# EasyEDA Pro project couple-pointing.eprj

# Schematic Schematic1
Create Date: 2023-10-11; Page Name: P1; Project Name: couple-pointing; Schematic Name: Schematic1; Update Date: 2023-10-14; Company: 嘉立创EDA; Page Size: A4; Version: V1.0
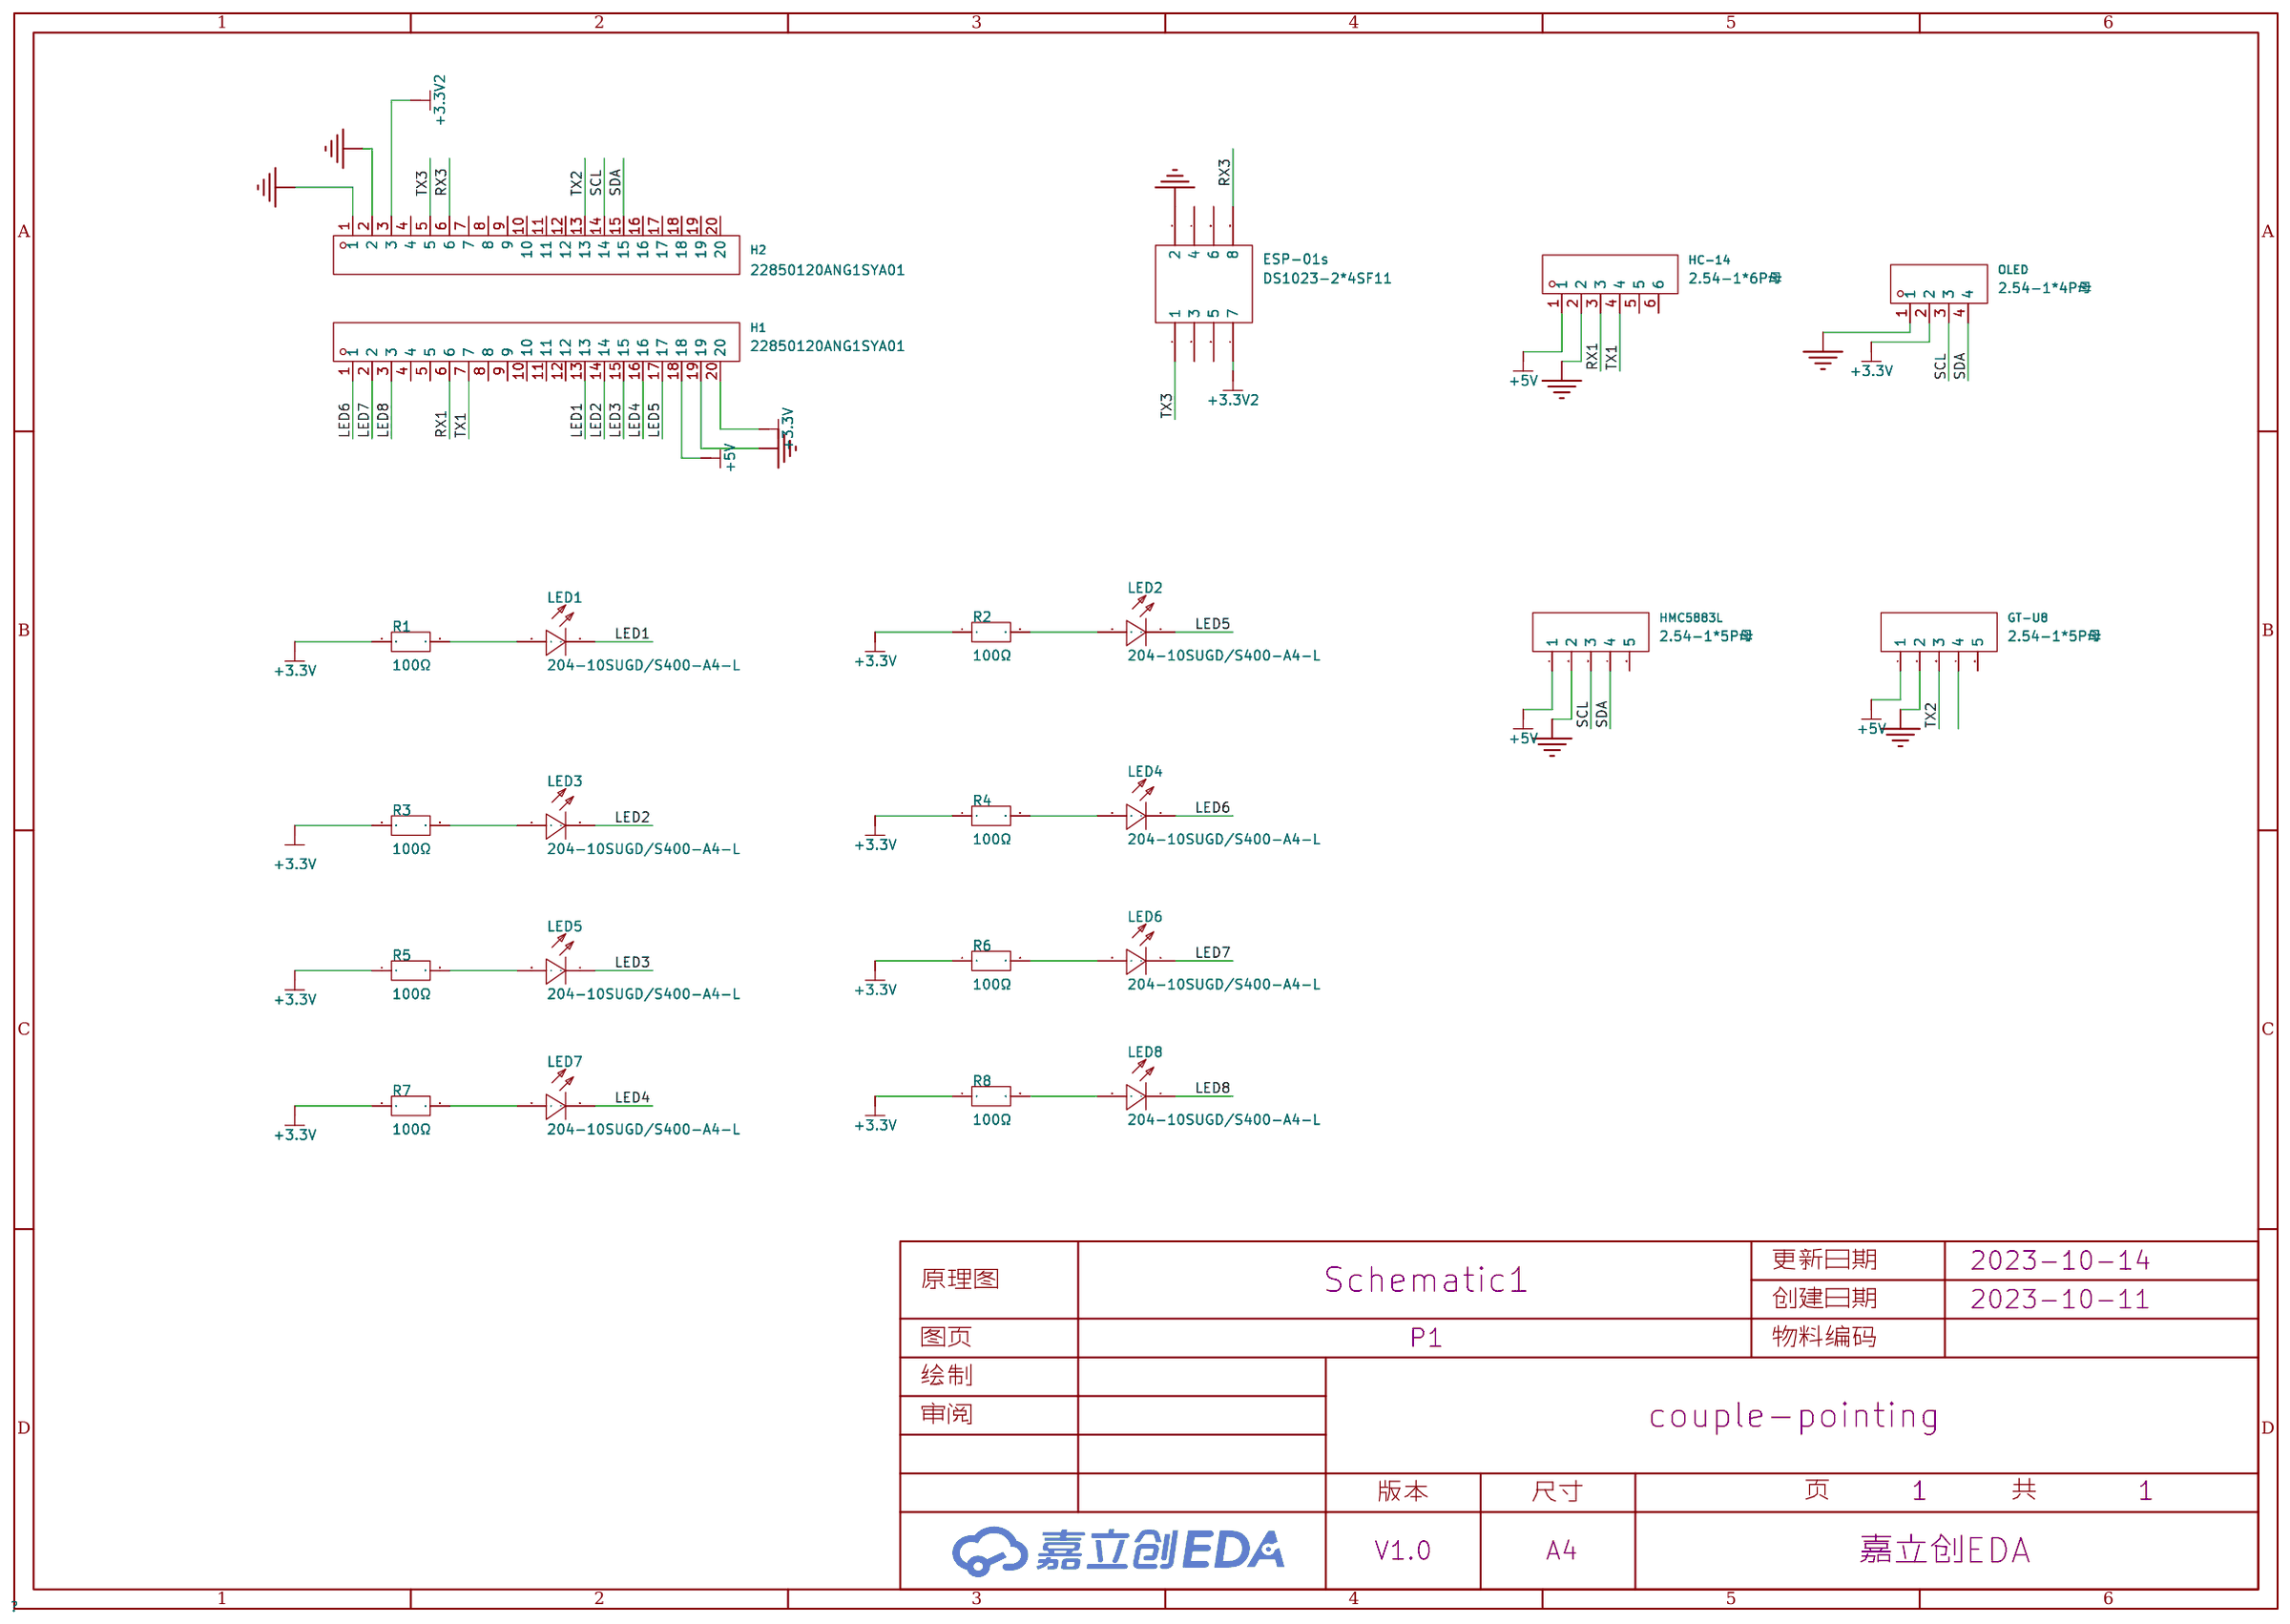
[diagram p0: schematic sheet]

## Parts
ESP-01s  DS1023-2*4SF11  [HDR-TH_8P-P2.54-V-F-R2-C4-S2.54]
GT-U8  2.54-1*5P母  [HDR-TH_5P-P2.54-V-F]
H1  22850120ANG1SYA01  [HDR-TH_20P-P2.54-V-F]
H2  22850120ANG1SYA01  [HDR-TH_20P-P2.54-V-F]
HC-14  2.54-1*6P母  [HDR-TH_6P-P2.54-V-F]
HMC5883L  2.54-1*5P母  [HDR-TH_5P-P2.54-V-F]
LED1  204-10SUGD/S400-A4-L  [LED-TH_BD3.9-P2.54-RD]
LED2  204-10SUGD/S400-A4-L  [LED-TH_BD3.9-P2.54-RD]
LED3  204-10SUGD/S400-A4-L  [LED-TH_BD3.9-P2.54-RD]
LED4  204-10SUGD/S400-A4-L  [LED-TH_BD3.9-P2.54-RD]
LED5  204-10SUGD/S400-A4-L  [LED-TH_BD3.9-P2.54-RD]
LED6  204-10SUGD/S400-A4-L  [LED-TH_BD3.9-P2.54-RD]
LED7  204-10SUGD/S400-A4-L  [LED-TH_BD3.9-P2.54-RD]
LED8  204-10SUGD/S400-A4-L  [LED-TH_BD3.9-P2.54-RD]
OLED  2.54-1*4P母  [HDR-TH_4P-P2.54-V-F]
R1  100Ω  [RES-TH_BD2.4-L6.3-P10.30-D0.6]
R2  100Ω  [RES-TH_BD2.4-L6.3-P10.30-D0.6]
R3  100Ω  [RES-TH_BD2.4-L6.3-P10.30-D0.6]
R4  100Ω  [RES-TH_BD2.4-L6.3-P10.30-D0.6]
R5  100Ω  [RES-TH_BD2.4-L6.3-P10.30-D0.6]
R6  100Ω  [RES-TH_BD2.4-L6.3-P10.30-D0.6]
R7  100Ω  [RES-TH_BD2.4-L6.3-P10.30-D0.6]
R8  100Ω  [RES-TH_BD2.4-L6.3-P10.30-D0.6]

## Library data of the parts
ESP-01s = DS1023-2*4SF11: 排数:双排;总孔位数:8P;间距:2.54mm;插孔结构:2x4P;行距:2.54mm;安装类型:直插;塑高:-;触头材质:-;触头镀层:-;; LCSC Part Name: 间距:2.54mm 2x4P 直插 黑色，镀全金; Supplier Part: C92271; Manufacturer: CONNFLY; Supplier Footprint: 插件,P=2.54mm; JLCPCB Part Class: 扩展库; Datasheet: https://atta.szlcsc.com/upload/public/pdf/source/20170925/C132132_1506321659018990428.pdf; Supplier: LCSC; Number of Rows: 双排; Number of Holes: 8P; Pitch: 2.54mm; Holes Structure: 2x4P; Row Spacing: 2.54mm; Mounting Type: 直插
GT-U8 HMC5883L = 2.54-1*5P母: 排数:单排;总孔位数:5P;间距:2.54mm;插孔结构:1x5P;行距:-;安装类型:直插;塑高:-;触头材质:-;触头镀层:-;; LCSC Part Name: 2.54mm 1x5P; Supplier Part: C50950; Manufacturer: BOOMELE(博穆精密); Supplier Footprint: 插件,P=2.54mm; JLCPCB Part Class: 扩展库; Datasheet: https://atta.szlcsc.com/upload/public/pdf/source/20210301/C2718488_F4427B881E42CAA8DDB0B1C12B3A522C.pdf; Supplier: LCSC; Number of Rows: 单排; Number of Holes: 5P; Pitch: 2.54mm; Holes Structure: 1x5P; Mounting Type: 直插
H1 H2 = 22850120ANG1SYA01: 排数:单排;总孔位数:20P;间距:2.54mm;插孔结构:1x20P;行距:-;安装类型:直插;塑高:-;触头材质:黄铜;触头镀层:-;; LCSC Part Name: 2.54mm 1x20P; Supplier Part: C429947; Manufacturer: JILN(锦凌); Supplier Footprint: 插件,P=2.54mm; JLCPCB Part Class: 扩展库; Datasheet: https://atta.szlcsc.com/upload/public/pdf/source/20190920/C429966_F6288D72CB1EF194DAF75E8AC5D57877.pdf; Supplier: LCSC; Number of Rows: 单排; Number of Holes: 20P; Pitch: 2.54mm; Holes Structure: 1x20P; Mounting Type: 直插; Contact Material: 黄铜
HC-14 = 2.54-1*6P母: 排数:单排;总孔位数:6P;间距:2.54mm;插孔结构:1x6P;行距:-;安装类型:直插;塑高:-;触头材质:-;触头镀层:-;; LCSC Part Name: 2.54mm 1x6P; Supplier Part: C40877; Manufacturer: BOOMELE(博穆精密); Supplier Footprint: 插件,P=2.54mm; JLCPCB Part Class: 扩展库; Datasheet: https://atta.szlcsc.com/upload/public/pdf/source/20210301/C2718488_F4427B881E42CAA8DDB0B1C12B3A522C.pdf; Supplier: LCSC; Number of Rows: 单排; Number of Holes: 6P; Pitch: 2.54mm; Holes Structure: 1x6P; Mounting Type: 直插
LED1-LED8 = 204-10SUGD/S400-A4-L: Supplier Part: C778892; Manufacturer: EVERLIGHT(亿光); Supplier Footprint: 插件; JLCPCB Part Class: Extended Part; Supplier: LCSC
OLED = 2.54-1*4P母: 排数:单排;总孔位数:4P;间距:2.54mm;插孔结构:1x4P;行距:-;安装类型:直插;圆孔/方孔:方孔;额定电流:3A;额定电压:-;插孔方向:顶部;塑高:-;触头材质:青铜;触头镀层:-;工作温度范围:-40℃~+105℃;焊接温度(最大值):-;; LCSC Part Name: 2.54mm 1x4P; Supplier Part: C2718488; Manufacturer: BOOMELE(博穆精密); Supplier Footprint: 插件,P=2.54mm; JLCPCB Part Class: 扩展库; Datasheet: https://atta.szlcsc.com/upload/public/pdf/source/20210301/C2718488_F4427B881E42CAA8DDB0B1C12B3A522C.pdf; Supplier: LCSC; Number of Rows: 单排; Number of Holes: 4P; Pitch: 2.54mm; Holes Structure: 1x4P; Mounting Type: 直插; Circular Hole / Square Hole: 方孔; Current Rating (Max): 3A; Holes Direction: 顶部; Contact Material: 青铜; Operating Temperature Range: -40℃~+105℃
R1-R8 = RN 1/4W 100R F T/B A1: 电阻类型:金属膜电阻;阻值:100Ω;精度:±1%;功率:250mW;温度系数:±50ppm/℃;最大工作电压:250V;工作温度范围:-55℃~+125℃;; LCSC Part Name: 金属膜电阻 100Ω ±1% 250mW; Supplier Part: C410697; Manufacturer: Tyohm(幸亚电阻); Supplier Footprint: 轴向引线; JLCPCB Part Class: Extended Part; Datasheet: https://atta.szlcsc.com/upload/public/pdf/source/20190808/C410697_B89CFE8EAECE794E000AD388AC8D1455.pdf; Supplier: LCSC; Type: 金属膜电阻; Tolerance: ±1%; Power(Watts): 250mW; Temperature Coefficient: ±50ppm/℃; Overload Voltage (Max): 250V; Operating Temperature Range: -55℃~+125℃

## Nets
+3.3V: H1.20 OLED.2 R1.1 R2.1 R3.1 R4.1 R5.1 R6.1 R7.1 R8.1
+3.3V2: ESP-01s.7 H2.3
+5V: GT-U8.1 H1.18 HC-14.1 HMC5883L.1
GND: ESP-01s.2 GT-U8.2 H1.19 H2.1 H2.2 HC-14.2 HMC5883L.2 OLED.1
LED1: H1.13 LED1.1(-)
LED2: H1.14 LED3.1(-)
LED3: H1.15 LED5.1(-)
LED4: H1.16 LED7.1(-)
LED5: H1.17 LED2.1(-)
LED6: H1.1 LED4.1(-)
LED7: H1.2 LED6.1(-)
LED8: H1.3 LED8.1(-)
RX1: H1.6 HC-14.3
RX3: ESP-01s.8 H2.6
SCL: H2.14 HMC5883L.3 OLED.3
SDA: H2.15 HMC5883L.4 OLED.4
TX1: H1.7 HC-14.4
TX2: GT-U8.3 H2.13
TX3: ESP-01s.1 H2.5
$1N1897: LED1.2(+) R1.2
$1N2548: LED3.2(+) R3.2
$1N2710: LED7.2(+) R7.2
$1N3180: LED2.2(+) R2.2
$1N3184: LED4.2(+) R4.2
$1N3188: LED6.2(+) R6.2
$1N3192: LED8.2(+) R8.2
$1N3281: LED5.2(+) R5.2

Not connected (* = marked no-connect by the designer): ESP-01s 3 4 5 6; GT-U8 4 5; H1 4 5 8 9 10 11 12; H2 4 7 8 9 10 11 12 16 17 18 19 20; HC-14 5 6; HMC5883L 5

# Board PCB1
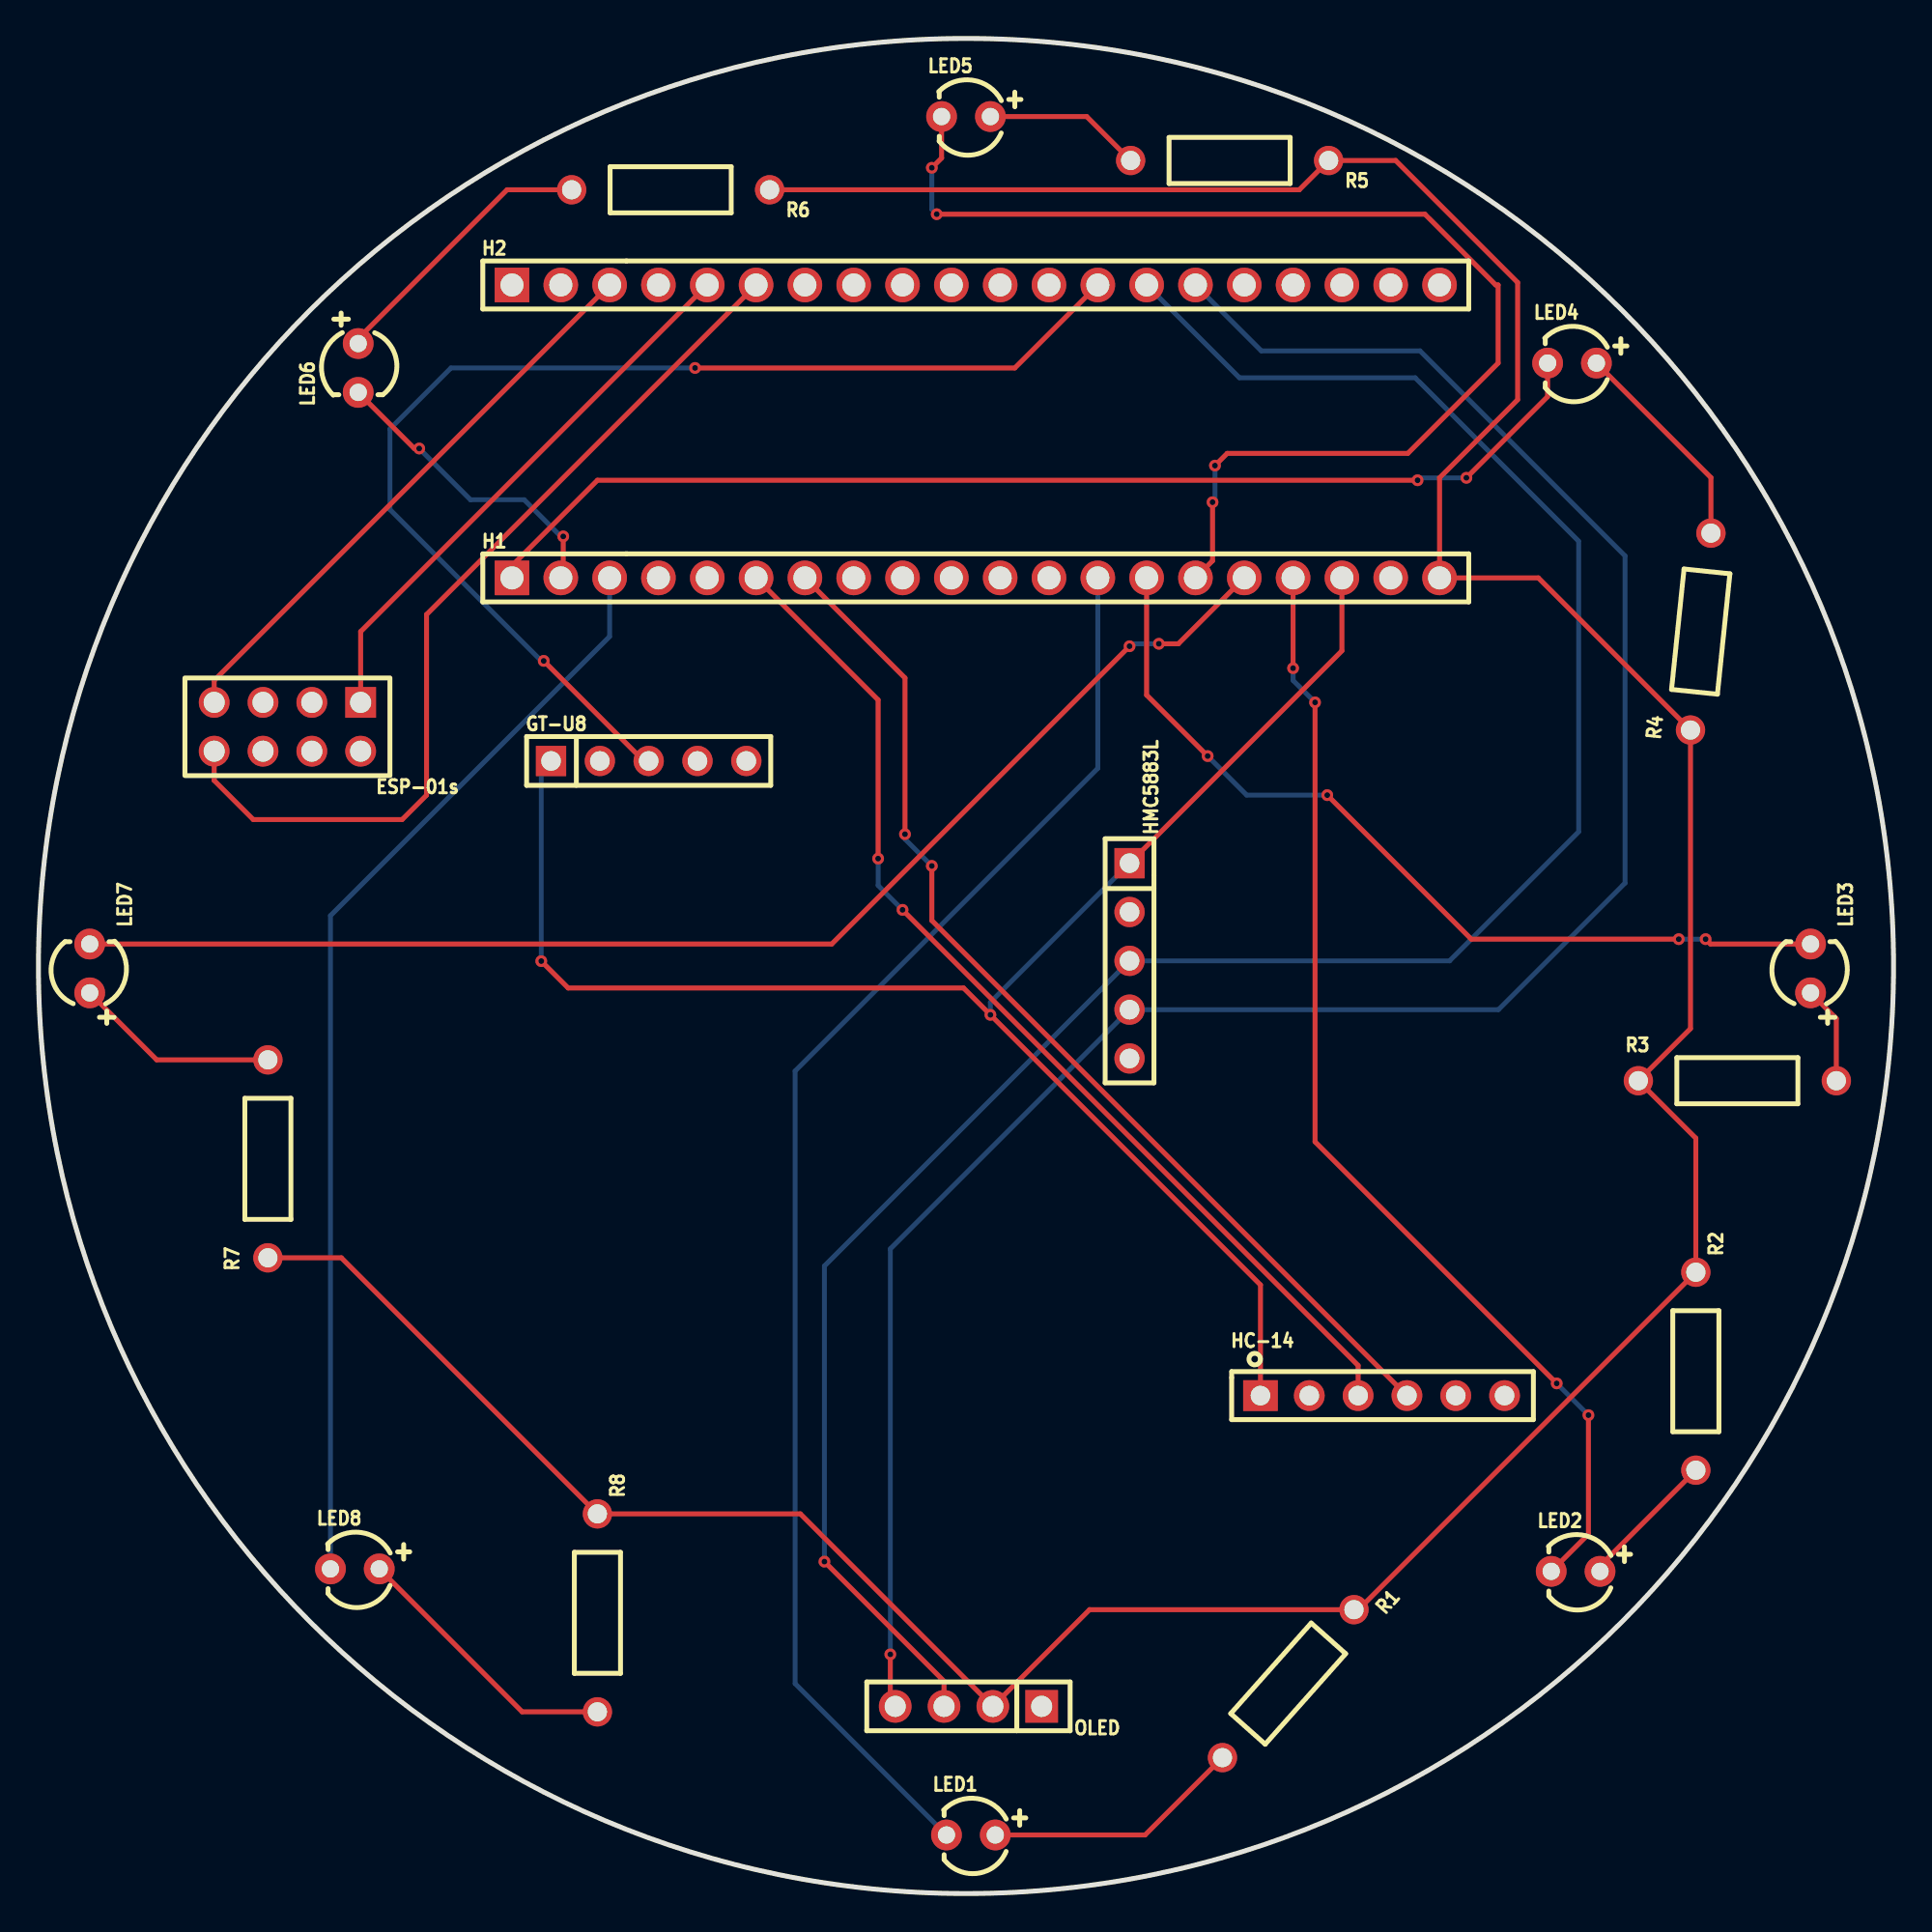
[diagram p1: board, top side]
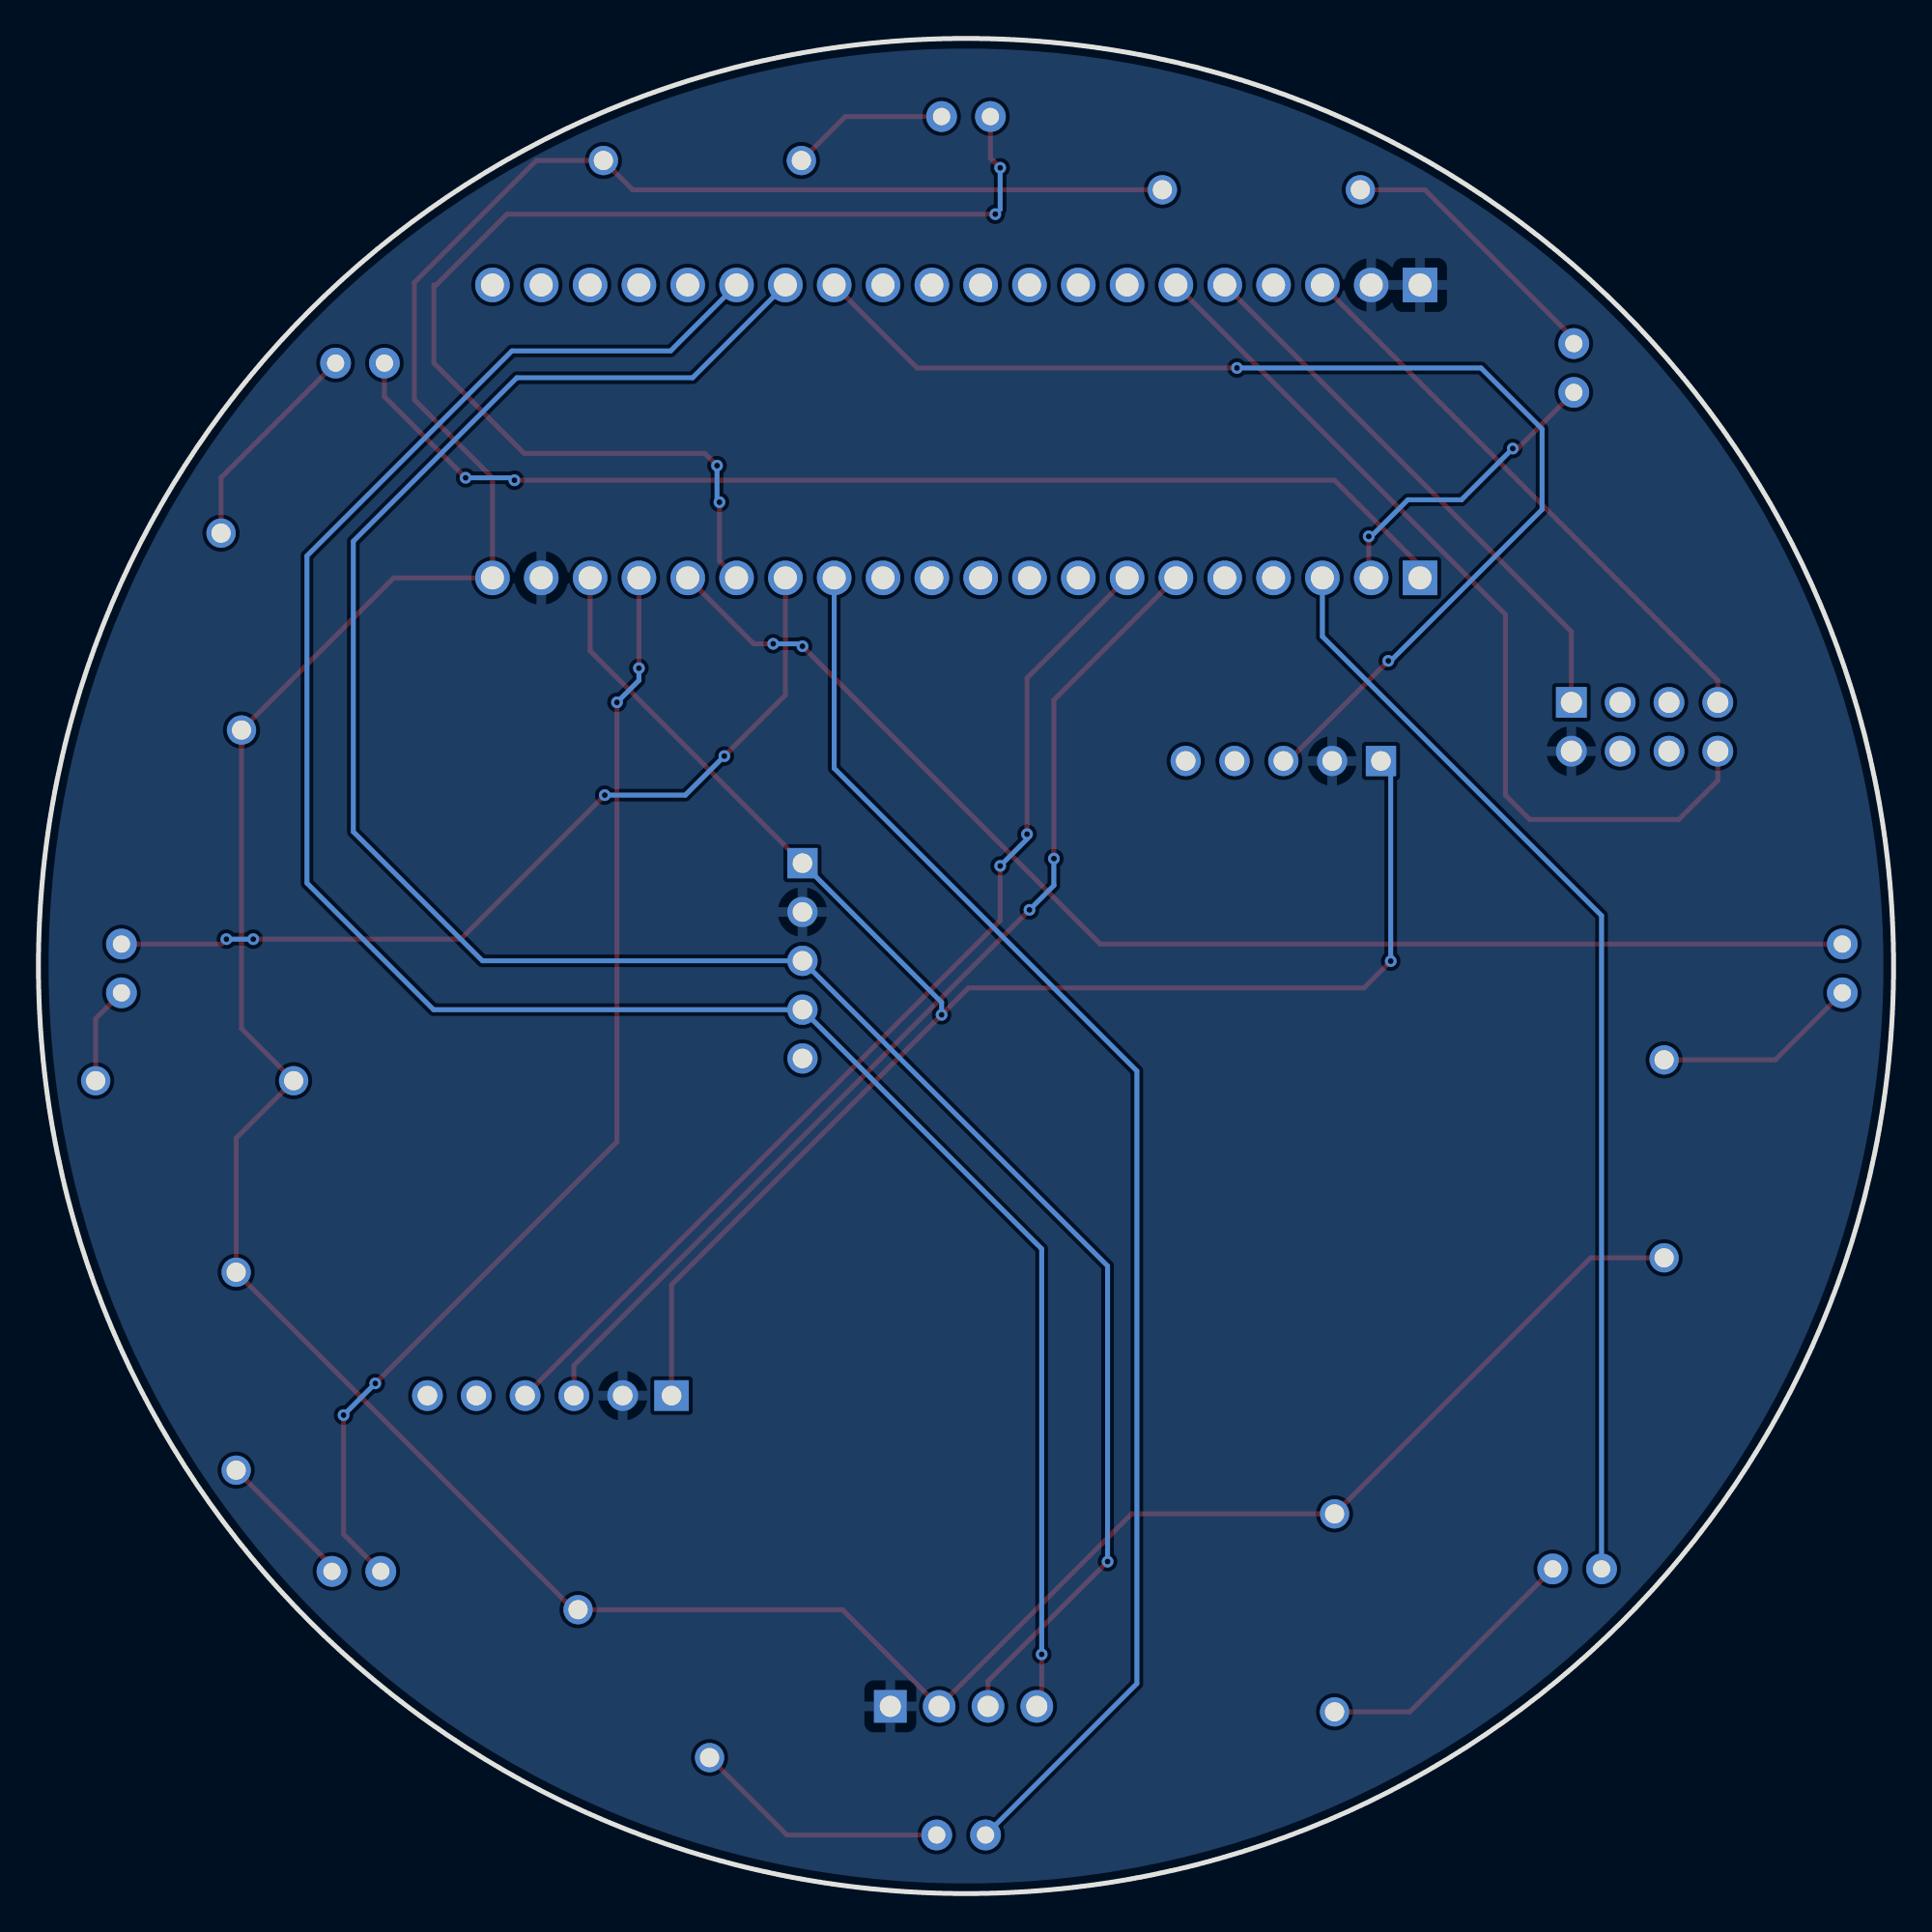
[diagram p2: board, bottom side, seen from below]

Outline 96.52 x 96.52 mm; copper layers: Top Layer, Bottom Layer. Coordinates in mm from the lower left corner of the outline.
Outline path: circle c48.26,48.26 r48.26
Stack: Top Layer 0.035mm / Dielectric1 1.51mm FR4 er 4.5 / Bottom Layer 0.035mm

## Design rules (mm)
template: JLCPCB Capability(Two Layers Board)
spacing copperThickness1oz (default): track to track 0.102, other pairs 0.152 to 0.3
spacing copperThickness2oz: track to track 0.203, other pairs 0.152 to 0.3
track width copperThickness1oz (default): min 0.127, default 0.254, max 2.54
track width copperThickness2oz: min 0.203, default 0.254, max 2.54
differential pair differentialPair (default): width min 0.127, default 0.254, max 2.54; gap min 0.152, default 0.152
via viaSize (default): diameter min 0.5, default 0.61, max 10; hole min 0.3, default 0.305, max 6.3

## Placement (name value [footprint] x y rotation side)
ESP-01s  DS1023-2*4SF11  [HDR-TH_8P-P2.54-V-F-R2-C4-S2.54]  12.95 60.71 180 top
GT-U8  2.54-1*5P母  [HDR-TH_5P-P2.54-V-F]  31.75 58.93 0 top
H1  22850120ANG1SYA01  [HDR-TH_20P-P2.54-V-F]  48.77 68.45 0 top
H2  22850120ANG1SYA01  [HDR-TH_20P-P2.54-V-F]  48.77 83.69 0 top
HC-14  2.54-1*6P母  [HDR-TH_6P-P2.54-V-F]  69.93 25.91 0 top
HMC5883L  2.54-1*5P母  [HDR-TH_5P-P2.54-V-F]  56.77 48.53 270 top
LED1  204-10SUGD/S400-A4-L  [LED-TH_BD3.9-P2.54-RD]  48.51 3.05 0 top
LED2  204-10SUGD/S400-A4-L  [LED-TH_BD3.9-P2.54-RD]  79.98 16.76 0 top
LED3  204-10SUGD/S400-A4-L  [LED-TH_BD3.9-P2.54-RD]  92.2 48.13 270 top
LED4  204-10SUGD/S400-A4-L  [LED-TH_BD3.9-P2.54-RD]  79.79 79.63 0 top
LED5  204-10SUGD/S400-A4-L  [LED-TH_BD3.9-P2.54-RD]  48.26 92.46 0 top
LED6  204-10SUGD/S400-A4-L  [LED-TH_BD3.9-P2.54-RD]  16.64 79.38 90 top
LED7  204-10SUGD/S400-A4-L  [LED-TH_BD3.9-P2.54-RD]  2.67 48.13 270 top
LED8  204-10SUGD/S400-A4-L  [LED-TH_BD3.9-P2.54-RD]  16.46 16.89 0 top
OLED  2.54-1*4P母  [HDR-TH_4P-P2.54-V-F]  48.39 9.74 180 top
R1  100Ω  [RES-TH_BD2.4-L6.3-P10.30-D0.6]  65.02 10.92 228.4 top
R2  100Ω  [RES-TH_BD2.4-L6.3-P10.30-D0.6]  86.23 27.18 270 top
R3  100Ω  [RES-TH_BD2.4-L6.3-P10.30-D0.6]  88.39 42.29 0 top
R4  100Ω  [RES-TH_BD2.4-L6.3-P10.30-D0.6]  86.49 65.66 84.1 top
R5  100Ω  [RES-TH_BD2.4-L6.3-P10.30-D0.6]  61.98 90.17 180 top
R6  100Ω  [RES-TH_BD2.4-L6.3-P10.30-D0.6]  32.89 88.65 180 top
R7  100Ω  [RES-TH_BD2.4-L6.3-P10.30-D0.6]  11.94 38.23 90 top
R8  100Ω  [RES-TH_BD2.4-L6.3-P10.30-D0.6]  29.08 14.61 270 top

## Footprints (pads in the part's own frame, mm; a bottom-side part is the same pattern mirrored in y, then rotated)
HDR-TH_4P-P2.54-V-F
  rect 1.7x1.7 hole 1.1: 1(-3.81,0)
  round 1.7 hole 1.1: 2(-1.27,0) 3(1.27,0) 4(3.81,0)
HDR-TH_5P-P2.54-V-F
  rect 1.575x1.575 hole 1.02: 1(-5.08,0)
  round 1.575 hole 1.02: 2(-2.54,0) 3(0,0) 4(2.54,0) 5(5.08,0)
HDR-TH_6P-P2.54-V-F
  rect 1.8x1.6 hole 1.02: 1(-6.35,0)
  round 1.6 hole 1.02: 2(-3.81,0) 3(-1.27,0) 4(1.27,0) 5(3.81,0) 6(6.35,0)
HDR-TH_8P-P2.54-V-F-R2-C4-S2.54
  rect 1.6x1.6 hole 1.1: 1(-3.81,-1.27)
  round 1.6 hole 1.1: 2(-3.81,1.27) 3(-1.27,-1.27) 4(-1.27,1.27) 5(1.27,-1.27) 6(1.27,1.27) 7(3.81,-1.27) 8(3.81,1.27)
HDR-TH_20P-P2.54-V-F
  rect 1.8x1.8 hole 1.2: 1(-24.13,0)
  round 1.8 hole 1.2: 2(-21.59,0) 3(-19.05,0) 4(-16.51,0) 5(-13.97,0) 6(-11.43,0) 7(-8.89,0) 8(-6.35,0) 9(-3.81,0) 10(-1.27,0) 11(1.27,0) 12(3.81,0) 13(6.35,0) 14(8.89,0) 15(11.43,0) 16(13.97,0) 17(16.51,0) 18(19.05,0) 19(21.59,0) 20(24.13,0)
LED-TH_BD3.9-P2.54-RD
  round 1.6 hole 0.9: 1(-1.27,0) 2(1.27,0)
RES-TH_BD2.4-L6.3-P10.30-D0.6
  round 1.524 hole 1: 1(-5.15,0) 2(5.15,0)

## Nets
As in the schematic.

Pads without a net: ESP-01s 3 4 5 6; GT-U8 5; H1 4 5 8 9 10 11 12; H2 4 7 8 9 10 11 12 16 17 18 19 20; HC-14 5 6; HMC5883L 5

## Via types
v1: diameter 0.61, hole 0.305, Top Layer to Bottom Layer, 38 vias

## Routing (per net, layer and track width the routed paths; a pad name or vN(x,y) marks a point on that pad's centre or on a via; arc(x,y) is an arc through that point)
+3.3V: length 199.5
  Top Layer w0.254: R7.1 15.76,33.08 R8.1 39.64,19.76 OLED.2 54.69,14.77 R1.1 68.68,14.77 R2.1 86.23,39.3 R3.1 85.96,45 R4.1 78.04,68.45 H1.20 72.9,73.66 76.96,77.72 76.96,83.82 70.61,90.17 R5.1 65.6,88.65 R6.1
+3.3V2: length 30.2
  Top Layer w0.254: ESP-01s.7 9.14,63.12 H2.3
+5V: length 91.1
  Top Layer w0.254: v1(26.16,48.51) 27.56,47.12 48.13,47.12 v1(49.53,45.72) 63.58,31.67 HC-14.1 ; v1(56.77,53.61) 67.82,64.66 v1(67.82,68.45)
  Bottom Layer w0.254: v1(56.77,53.61) 49.53,46.37 v1(49.53,45.72) ; GT-U8.1 26.16,58.42 v1(26.16,48.51)
LED1: length 75.2
  Bottom Layer w0.254: v1(47.24,3.05) 39.37,10.92 39.37,42.8 55.12,58.55 H1.13
LED2: length 46
  Top Layer w0.254: v1(57.66,68.45) 57.66,62.36 v1(60.83,59.18) ; v1(85.34,49.66) 74.55,49.66 v1(67.06,57.15) ; v1(86.74,49.66) 87,49.4 LED3.1
  Bottom Layer w0.254: v1(67.06,57.15) 62.87,57.15 v1(60.83,59.18) ; v1(85.34,49.66) v1(86.74,49.66)
LED3: length 63.4
  Top Layer w0.254: v1(61.21,74.3) 61.85,74.93 71.25,74.93 75.95,79.63 75.95,83.69 75.82,83.69 72.14,87.38 v1(46.74,87.38) ; 46.99,92.46 46.99,90.3 v1(46.48,89.79) ; H1.15 61.09,69.34 v1(61.09,72.39)
  Bottom Layer w0.254: v1(61.21,74.3) 61.21,72.52 v1(61.09,72.39) ; v1(46.74,87.38) 46.48,87.63 v1(46.48,89.79)
LED4: length 68
  Top Layer w0.254: H1.16 59.31,65.02 v1(58.29,65.02) ; v1(56.77,64.9) 41.28,49.4 LED7.1
  Bottom Layer w0.254: v1(56.77,64.9) 56.9,65.02 v1(58.29,65.02)
LED5: length 58.9
  Top Layer w0.254: H1.17 v1(65.28,63.75) ; v1(80.65,24.89) 80.65,18.7 v1(78.71,16.76) ; v1(66.42,61.98) 66.42,39.12 v1(78.99,26.54)
  Bottom Layer w0.254: v1(78.99,26.54) v1(80.65,24.89) ; v1(65.28,63.75) 65.28,63.12 v1(66.42,61.98)
LED6: length 59.9
  Top Layer w0.254: H1.1 24.64,69.09 29.08,73.53 v1(71.76,73.53) ; LED4.1 78.52,77.89 v1(74.3,73.66)
  Bottom Layer w0.254: v1(71.76,73.53) 71.88,73.66 v1(74.3,73.66)
LED7: length 16
  Top Layer w0.254: v1(27.31,70.61) 27.31,68.58 H1.2 ; v1(16.64,78.11) 19.56,75.18 v1(19.81,75.18)
  Bottom Layer w0.254: v1(27.31,70.61) 27.18,70.61 25.27,72.52 22.48,72.52 v1(19.81,75.18)
LED8: length 57.6
  Bottom Layer w0.254: H1.3 29.72,65.41 15.19,50.88 v1(15.19,16.89)
RX1: length 55.5
  Top Layer w0.254: v1(43.69,53.85) 43.69,62.1 H1.6 ; HC-14.3 68.66,27.48 v1(44.96,51.18)
  Bottom Layer w0.254: v1(43.69,53.85) 43.69,52.45 v1(44.96,51.18)
RX3: length 47.6
  Top Layer w0.254: v1(37.34,83.69) 20.19,66.55 20.19,57.15 18.92,55.88 11.18,55.88 9.14,57.91 ESP-01s.8
SCL: length 117.2
  Top Layer w0.254: OLED.3 47.12,11.05 v1(40.89,17.27)
  Bottom Layer w0.254: H2.14 62.48,78.87 71.63,78.87 80.14,70.36 80.14,55.25 73.42,48.53 HMC5883L.3 40.89,32.65 v1(40.89,17.27)
SDA: length 115.2
  Top Layer w0.254: v1(44.32,12.45) 44.32,9.99 OLED.4
  Bottom Layer w0.254: v1(44.32,12.45) 44.32,33.54 HMC5883L.4 75.96,45.99 82.55,52.58 82.55,69.6 71.88,80.26 63.63,80.26 v1(60.2,83.69)
TX1: length 55.5
  Top Layer w0.254: H1.7 45.09,63.25 v1(45.09,55.12) ; v1(46.48,53.47) 46.48,50.63 v1(71.2,25.91)
  Bottom Layer w0.254: v1(45.09,55.12) 45.09,54.86 v1(46.48,53.47)
TX2: length 62.9
  Top Layer w0.254: H2.13 50.8,79.38 v1(34.16,79.38) ; v1(26.29,64.14) 31.24,59.18 31.24,58.67
  Bottom Layer w0.254: v1(26.29,64.14) 26.16,64.14 18.29,72.01 18.29,76.2 21.46,79.38 v1(34.16,79.38)
TX3: length 29.2
  Top Layer w0.254: H2.5 16.76,65.66 ESP-01s.1
$1N1897: length 13.5
  Top Layer w0.254: R1.2 57.58,3.05 49.78,3.05
$1N2548: length 5.1
  Top Layer w0.254: LED3.2 93.54,45.52 R3.2
$1N2710: length 10.7
  Top Layer w0.254: LED7.2 6.15,43.38 R7.2
$1N3180: length 7.3
  Top Layer w0.254: R2.2 81.25,17.04 81.25,16.76
$1N3184: length 11.3
  Top Layer w0.254: LED4.2 87.02,73.67 R4.2
$1N3188: length 14.6
  Top Layer w0.254: R6.2 24.38,88.65 16.64,80.9 LED6.2
$1N3192: length 14.4
  Top Layer w0.254: R8.2 25.17,9.46 LED8.2
$1N3281: length 8.2
  Top Layer w0.254: R5.2 54.54,92.46 LED5.2

## Copper pours and planes (outline as drawn; the poured copper is in the pictures)
GND on Bottom Layer: 95.99,48.93 95.95,50.27 95.88,51.6 95.77,52.94 95.62,54.27 95.43,55.6 95.2,56.92 94.94,58.23 94.65,59.53 94.31,60.83 93.94,62.12 93.53,63.39 93.09,64.66 92.61,65.91 92.1,67.14 91.55,68.37 90.97,69.57 90.36,70.76 89.71,71.93 89.03,73.09 88.32,74.22 87.57,75.33 86.8,76.43 85.99,77.5 85.16,78.54 84.3,79.57 83.4,80.56 82.48,81.54 81.54,82.48 80.56,83.4 79.57,84.3 78.54,85.16 77.5,85.99 76.43,86.8 75.33,87.57 74.22,88.32 73.09,89.03 71.93,89.71 70.76,90.36 69.57,90.97 68.37,91.55 67.14,92.1 65.91,92.61 64.66,93.09 63.39,93.53 62.12,93.94 60.83,94.31 59.53,94.65 58.23,94.94 56.92,95.2 55.6,95.43 54.27,95.62 52.94,95.77 51.6,95.88 50.27,95.95 48.93,95.99 47.59,95.99 46.25,95.95 44.92,95.88 43.58,95.77 42.25,95.62 40.92,95.43 39.6,95.2 38.29,94.94 36.99,94.65 35.69,94.31 34.4,93.94 33.13,93.53 31.86,93.09 30.61,92.61 29.38,92.1 28.15,91.55 26.95,90.97 25.76,90.36 24.59,89.71 23.43,89.03 22.3,88.32 21.19,87.57 20.09,86.8 19.02,85.99 17.98,85.16 16.95,84.3 15.96,83.4 14.98,82.48 14.04,81.54 13.12,80.56 12.22,79.57 11.36,78.54 10.53,77.5 9.72,76.43 8.95,75.33 8.2,74.22 7.49,73.09 6.81,71.93 6.16,70.76 5.55,69.57 4.97,68.37 4.42,67.14 3.91,65.91 3.43,64.66 2.99,63.39 2.58,62.12 2.21,60.83 1.87,59.53 1.58,58.23 1.32,56.92 1.09,55.6 0.9,54.27 0.75,52.94 0.64,51.6 0.57,50.27 0.53,48.93 0.53,47.59 0.57,46.25 0.64,44.92 0.75,43.58 0.9,42.25 1.09,40.92 1.32,39.6 1.58,38.29 1.87,36.99 2.21,35.69 2.58,34.4 2.99,33.13 3.43,31.86 3.91,30.61 4.42,29.38 4.97,28.15 5.55,26.95 6.16,25.76 6.81,24.59 7.49,23.43 8.2,22.3 8.95,21.19 9.72,20.09 10.53,19.02 11.36,17.98 12.22,16.95 13.12,15.96 14.04,14.98 14.98,14.04 15.96,13.12 16.95,12.22 17.98,11.36 19.02,10.53 20.09,9.72 21.19,8.95 22.3,8.2 23.43,7.49 24.59,6.81 25.76,6.16 26.95,5.55 28.15,4.97 29.38,4.42 30.61,3.91 31.86,3.43 33.13,2.99 34.4,2.58 35.69,2.21 36.99,1.87 38.29,1.58 39.6,1.32 40.92,1.09 42.25,0.9 43.58,0.75 44.92,0.64 46.25,0.57 47.59,0.53 48.93,0.53 50.27,0.57 51.6,0.64 52.94,0.75 54.27,0.9 55.6,1.09 56.92,1.32 58.23,1.58 59.53,1.87 60.83,2.21 62.12,2.58 63.39,2.99 64.66,3.43 65.91,3.91 67.14,4.42 68.37,4.97 69.57,5.55 70.76,6.16 71.93,6.81 73.09,7.49 74.22,8.2 75.33,8.95 76.43,9.72 77.5,10.53 78.54,11.36 79.57,12.22 80.56,13.12 81.54,14.04 82.48,14.98 83.4,15.96 84.3,16.95 85.16,17.98 85.99,19.02 86.8,20.09 87.57,21.19 88.32,22.3 89.03,23.43 89.71,24.59 90.36,25.76 90.97,26.95 91.55,28.15 92.1,29.38 92.61,30.61 93.09,31.86 93.53,33.13 93.94,34.4 94.31,35.69 94.65,36.99 94.94,38.29 95.2,39.6 95.43,40.92 95.62,42.25 95.77,43.58 95.88,44.92 95.95,46.25 95.99,47.59
